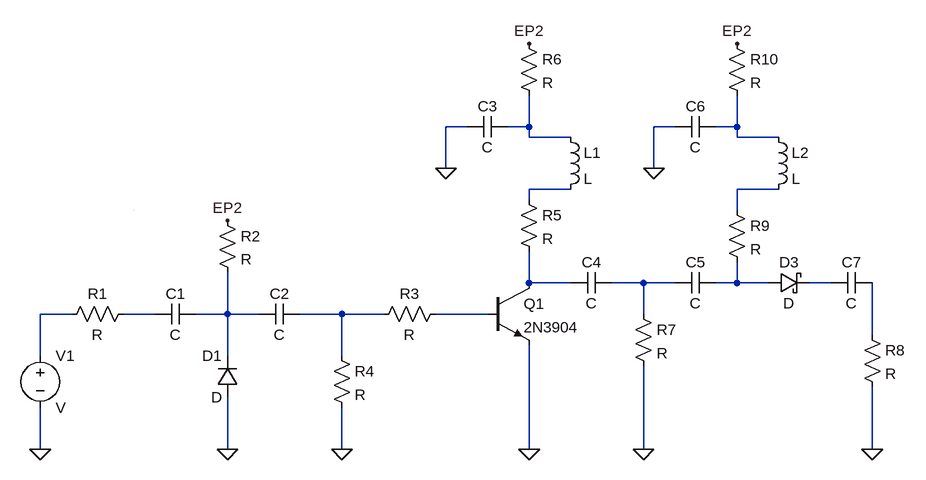
[diagram p0: schematic SamplingPulseGeneration.asc]
SamplingPulseGeneration.asc, the LTspice schematic file:
Version 4
SHEET 1 1192 680
WIRE 512 -128 480 -128
WIRE 608 -128 608 -176
WIRE 608 -128 576 -128
WIRE 832 -128 800 -128
WIRE 928 -128 928 -176
WIRE 928 -128 896 -128
WIRE 608 -112 608 -128
WIRE 672 -112 608 -112
WIRE 928 -112 928 -128
WIRE 992 -112 928 -112
WIRE 480 -64 480 -128
WIRE 800 -64 800 -128
WIRE 672 -32 608 -32
WIRE 992 -32 928 -32
WIRE 608 -16 608 -32
WIRE 928 0 928 -32
WIRE 608 112 608 64
WIRE 672 112 608 112
WIRE 784 112 736 112
WIRE 832 112 784 112
WIRE 928 112 928 80
WIRE 928 112 896 112
WIRE 976 112 928 112
WIRE 1072 112 1040 112
WIRE -96 160 -144 160
WIRE 32 160 -16 160
WIRE 144 160 144 96
WIRE 144 160 96 160
WIRE 192 160 144 160
WIRE 320 160 256 160
WIRE 384 160 320 160
WIRE 544 160 464 160
WIRE 784 160 784 112
WIRE 1136 192 1136 112
WIRE -144 224 -144 160
WIRE 144 224 144 160
WIRE 320 224 320 160
WIRE -144 368 -144 304
WIRE 144 368 144 288
WIRE 320 368 320 304
WIRE 608 368 608 208
WIRE 784 368 784 240
WIRE 1136 368 1136 272
WIRE 0 0 0 0
FLAG -144 368 0
FLAG 144 368 0
FLAG 320 368 0
FLAG 608 368 0
FLAG 784 368 0
FLAG 1136 368 0
FLAG 800 -64 0
FLAG 480 -64 0
FLAG 608 -256 EP2
FLAG 928 -256 EP2
FLAG 144 16 EP2
SYMBOL cap 96 144 R90
WINDOW 0 0 32 VBottom 2
WINDOW 3 32 32 VTop 2
SYMATTR InstName C1
SYMBOL cap 256 144 R90
WINDOW 0 0 32 VBottom 2
WINDOW 3 32 32 VTop 2
SYMATTR InstName C2
SYMBOL res 0 144 R90
WINDOW 0 0 56 VBottom 2
WINDOW 3 32 56 VTop 2
SYMATTR InstName R1
SYMBOL res 128 0 R0
SYMATTR InstName R2
SYMBOL res 480 144 R90
WINDOW 0 0 56 VBottom 2
WINDOW 3 32 56 VTop 2
SYMATTR InstName R3
SYMBOL res 304 208 R0
SYMATTR InstName R4
SYMBOL npn 544 112 R0
SYMATTR InstName Q1
SYMATTR Value 2N3904
SYMBOL cap 576 -144 R90
WINDOW 0 0 32 VBottom 2
WINDOW 3 32 32 VTop 2
SYMATTR InstName C3
SYMBOL ind 656 -128 R0
SYMATTR InstName L1
SYMBOL res 592 -32 R0
SYMATTR InstName R5
SYMBOL res 592 -272 R0
SYMATTR InstName R6
SYMBOL cap 736 96 R90
WINDOW 0 0 32 VBottom 2
WINDOW 3 32 32 VTop 2
SYMATTR InstName C4
SYMBOL res 768 144 R0
SYMATTR InstName R7
SYMBOL cap 896 96 R90
WINDOW 0 0 32 VBottom 2
WINDOW 3 32 32 VTop 2
SYMATTR InstName C5
SYMBOL diode 160 288 R180
WINDOW 0 24 64 Left 2
WINDOW 3 24 0 Left 2
SYMATTR InstName D1
SYMBOL res 1120 176 R0
SYMATTR InstName R8
SYMBOL res 912 -16 R0
SYMATTR InstName R9
SYMBOL ind 976 -128 R0
SYMATTR InstName L2
SYMBOL cap 896 -144 R90
WINDOW 0 0 32 VBottom 2
WINDOW 3 32 32 VTop 2
SYMATTR InstName C6
SYMBOL cap 1136 96 R90
WINDOW 0 0 32 VBottom 2
WINDOW 3 32 32 VTop 2
SYMATTR InstName C7
SYMBOL res 912 -272 R0
SYMATTR InstName R10
SYMBOL schottky 976 128 R270
WINDOW 0 32 32 VTop 2
WINDOW 3 0 32 VBottom 2
SYMATTR InstName D3
SYMBOL voltage -144 208 R0
SYMATTR InstName V1

The netlist it stands for:
* SamplingPulseGeneration.asc
C1 N011 N010 C
C2 N012 N011 C
R1 N010 N009 R
R2 EP2 N011 R
R3 N013 N012 R
R4 N012 0 R
Q1 N005 N013 0 0 2N3904
C3 N001 0 C
L1 N001 N003 L
R5 N003 N005 R
R6 EP2 N001 R
C4 N006 N005 C
R7 N006 0 R
C5 N007 N006 C
D1 0 N011 D
R8 N014 0 R
R9 N004 N007 R
L2 N002 N004 L
C6 N002 0 C
C7 N014 N008 C
R10 EP2 N002 R
D3 N007 N008 D
V1 N009 0 V
.model D D
.lib standard.dio
.model NPN NPN
.model PNP PNP
.lib standard.bjt
.backanno
.end